# EAGLE design base (EAGLE 7.7.0)
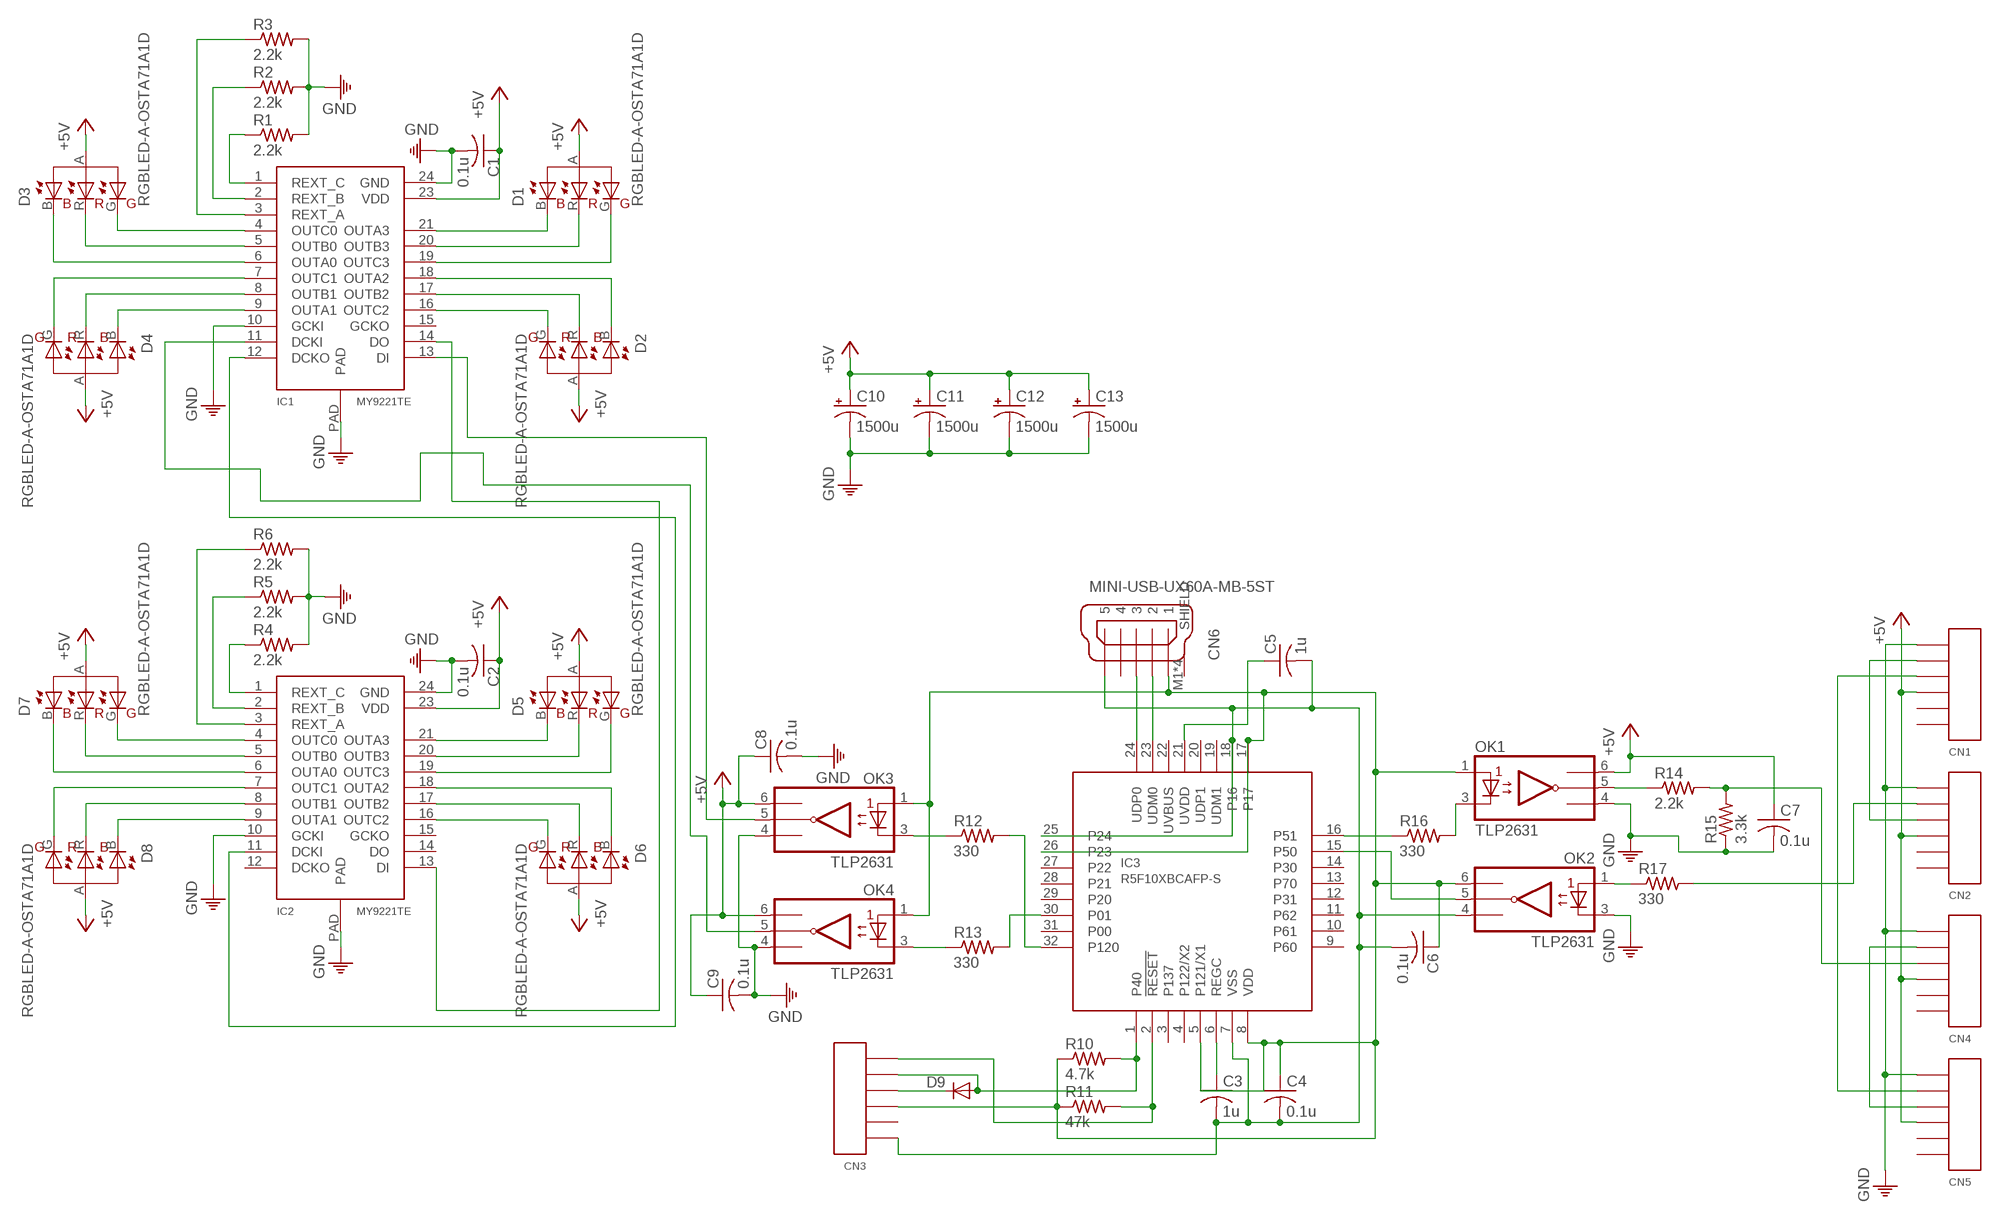
[diagram p0: schematic, sheet 1]

## Parts
C1  0.1u  C2012  [C2012]
C2  0.1u  C2012  [C2012]
C3  1u  C2012  [C2012]
C4  0.1u  C2012  [C2012]
C5  1u  C2012  [C2012]
C6  0.1u  C2012  [C2012]
C7  0.1u  C2012  [C2012]
C8  0.1u  C2012  [C2012]
C9  0.1u  C2012  [C2012]
C10  1500u  CCE3.5-8  [E3,5-8]
C11  1500u  CCE3.5-8  [E3,5-8]
C12  1500u  CCE3.5-8  [E3,5-8]
C13  1500u  CCE3.5-8  [E3,5-8]
CN1  PH-1X06SG  [PH-1X06SG]
CN2  PH-1X06SG  [PH-1X06SG]
CN3  PH-1X06SG  [PH-1X06SG]
CN4  PH-1X06SG  [PH-1X06SG]
CN5  PH-1X06SG  [PH-1X06SG]
CN6  MINI-USB-UX60A-MB-5ST  [UX60A-MB-5ST]
D1  RGBLED-A-OSTA71A1D  [OSTA71A1D]
D2  RGBLED-A-OSTA71A1D  [OSTA71A1D]
D3  RGBLED-A-OSTA71A1D  [OSTA71A1D]
D4  RGBLED-A-OSTA71A1D  [OSTA71A1D]
D5  RGBLED-A-OSTA71A1D  [OSTA71A1D]
D6  RGBLED-A-OSTA71A1D  [OSTA71A1D]
D7  RGBLED-A-OSTA71A1D  [OSTA71A1D]
D8  RGBLED-A-OSTA71A1D  [OSTA71A1D]
D9  D-SOD123  [SOD123]
IC1  MY9221TE  [MY9221TE]
IC2  MY9221TE  [MY9221TE]
IC3  R5F10XBCAFP-S  [P-LQFP32-7X7-0.80S]
OK1  TLP2631  [11-4L1S]
OK2  TLP2631  [11-4L1S]
OK3  TLP2631  [11-4L1S]
OK4  TLP2631  [11-4L1S]
R1  2.2k  R2012  [R2012]
R2  2.2k  R2012  [R2012]
R3  2.2k  R2012  [R2012]
R4  2.2k  R2012  [R2012]
R5  2.2k  R2012  [R2012]
R6  2.2k  R2012  [R2012]
R10  4.7k  R2012  [R2012]
R11  47k  R2012  [R2012]
R12  330  R2012  [R2012]
R13  330  R2012  [R2012]
R14  2.2k  R2012  [R2012]
R15  3.3k  R2012  [R2012]
R16  330  R2012  [R2012]
R17  330  R2012  [R2012]

## Nets
+5V: C1.1 C2.1 C7.1 C8.1 C9.1 C10.+ C11.+ C12.+ C13.+ CN1.P$4 CN2.P$4 CN4.P$4 CN5.P$4 D1.A(CA) D2.A(CA) D3.A(CA) D4.A(CA) D5.A(CA) D6.A(CA) D7.A(CA) D8.A(CA) IC1.23(VDD) IC2.23(VDD) OK1.6(VCC) OK3.6(VCC) OK4.6(VCC)
GND: C1.2 C2.2 C7.2 C8.2 C9.2 C10.- C11.- C12.- C13.- CN1.P$1 CN2.P$1 CN4.P$1 CN5.P$1 IC1.10(GCKI) IC1.24(GND) IC1.PAD IC2.10(GCKI) IC2.24(GND) IC2.PAD OK1.4(GND) OK2.3(C1) OK3.4(GND) OK4.4(GND) R1.2 R2.2 R3.2 R4.2 R5.2 R6.2 R15.1
N$1: D3.G(GC) IC1.4(OUTC0)
N$2: D3.R(RC) IC1.5(OUTB0)
N$3: D3.B(BC) IC1.6(OUTA0)
N$4: D4.G(GC) IC1.7(OUTC1)
N$5: D4.R(RC) IC1.8(OUTB1)
N$6: D4.B(BC) IC1.9(OUTA1)
N$7: D2.G(GC) IC1.16(OUTC2)
N$8: D2.R(RC) IC1.17(OUTB2)
N$9: D2.B(BC) IC1.18(OUTA2)
N$10: D1.G(GC) IC1.19(OUTC3)
N$11: D1.R(RC) IC1.20(OUTB3)
N$12: D1.B(BC) IC1.21(OUTA3)
N$13: D7.G(GC) IC2.4(OUTC0)
N$14: IC1.1(REXT_C) R1.1
N$15: IC1.2(REXT_B) R2.1
N$16: IC1.3(REXT_A) R3.1
N$17: D7.R(RC) IC2.5(OUTB0)
N$18: D7.B(BC) IC2.6(OUTA0)
N$19: D8.G(GC) IC2.7(OUTC1)
N$20: D8.R(RC) IC2.8(OUTB1)
N$21: D8.B(BC) IC2.9(OUTA1)
N$22: D6.G(GC) IC2.16(OUTC2)
N$23: D6.R(RC) IC2.17(OUTB2)
N$24: D6.B(BC) IC2.18(OUTA2)
N$25: D5.G(GC) IC2.19(OUTC3)
N$26: D5.R(RC) IC2.20(OUTB3)
N$27: D5.B(BC) IC2.21(OUTA3)
N$28: IC2.1(REXT_C) R4.1
N$29: IC2.2(REXT_B) R5.1
N$30: IC2.3(REXT_A) R6.1
N$31: IC1.14(DO) IC2.13(DI)
N$32: IC1.12(DCKO) IC2.11(DCKI)
N$33: IC3.30(P01) R13.2
N$34: CN3.P$3 D9.C
N$35: CN1.P$2 CN2.P$3
N$36: CN2.P$2 R17.2
N$37: CN4.P$2 CN5.P$3
N$38: CN3.P$2 D9.A IC3.1(P40) R10.2
N$39: CN1.P$3 CN5.P$2
N$40: CN4.P$3 R14.2 R15.2
N$41: CN6.2 IC3.23(UDM0)
N$42: CN6.3 IC3.24(UDP0)
N$44: CN3.P$1 IC3.2(!RESET!) R11.2
N$45: C4.1 C6.1 CN3.P$4 CN6.1 IC3.5(P121/X1) IC3.8(VDD) IC3.17 IC3.26(P23) OK1.1(A1) OK2.6(VCC) OK3.1(A1) OK4.1(A1) R10.1 R11.1
N$46: C3.1 IC3.6(REGC)
N$47: OK3.3(C1) R12.1
N$48: OK4.3(C1) R13.1
N$50: IC3.32(P120) R12.2
N$51: C3.2 C4.2 C5.2 C6.2 CN3.P$6 CN6.5 IC3.7(VSS) IC3.18(P16) IC3.25(P24) OK2.4(GND)
N$52: IC1.11(DCKI) OK4.5(VO1)
N$55: IC1.13(DI) OK3.5(VO1)
N$56: C5.1 IC3.21(UVDD)
N$58: OK1.5(VO1) R14.1
N$59: OK1.3(C1) R16.2
N$60: IC3.15(P50) OK2.5(VO1)
N$61: OK2.1(A1) R17.1
N$62: IC3.16(P51) R16.1
Unconnected: CN1.P$5 CN1.P$6 CN2.P$5 CN2.P$6 CN3.P$5 CN4.P$5 CN4.P$6 CN5.P$5 CN5.P$6 CN6.4 CN6.M1(SHIELD) CN6.M2(SHIELD) CN6.M3(SHIELD) CN6.M4(SHIELD) IC1.15(GCKO) IC2.12(DCKO) IC2.14(DO) IC2.15(GCKO) IC3.3(P137) IC3.4(P122/X2) IC3.9(P60) IC3.10(P61) IC3.11(P62) IC3.12(P31) IC3.13(P70) IC3.14(P30) IC3.19(UDM1) IC3.20(UDP1) IC3.22(UVBUS) IC3.27(P22) IC3.28(P21) IC3.29(P20) IC3.31(P00)

## Library data of the parts
C1-C9 = MyLib:C: CAPACITOR, American symbol
C10-C13 = MyLib:CC: POLARIZED CAPACITOR, American symbol
CN1-CN5 = MyLib:PH-1X06
CN6 = MyLib:MINI-USB-: MINI USB Connector Source: http://www.hirose.co.jp/cataloge_hp/e24000019.pdf
D1-D8 = MyLib:RGBLED-A
D9 = MyLib:D
IC1 IC2 = MyLib:MY9221
IC3 = MyLib:R5F10XBC*FP
OK1-OK4 = MyLib:TLP2631
R1-R6 R10-R17 = MyLib:R: RESISTOR, American symbol

## Board
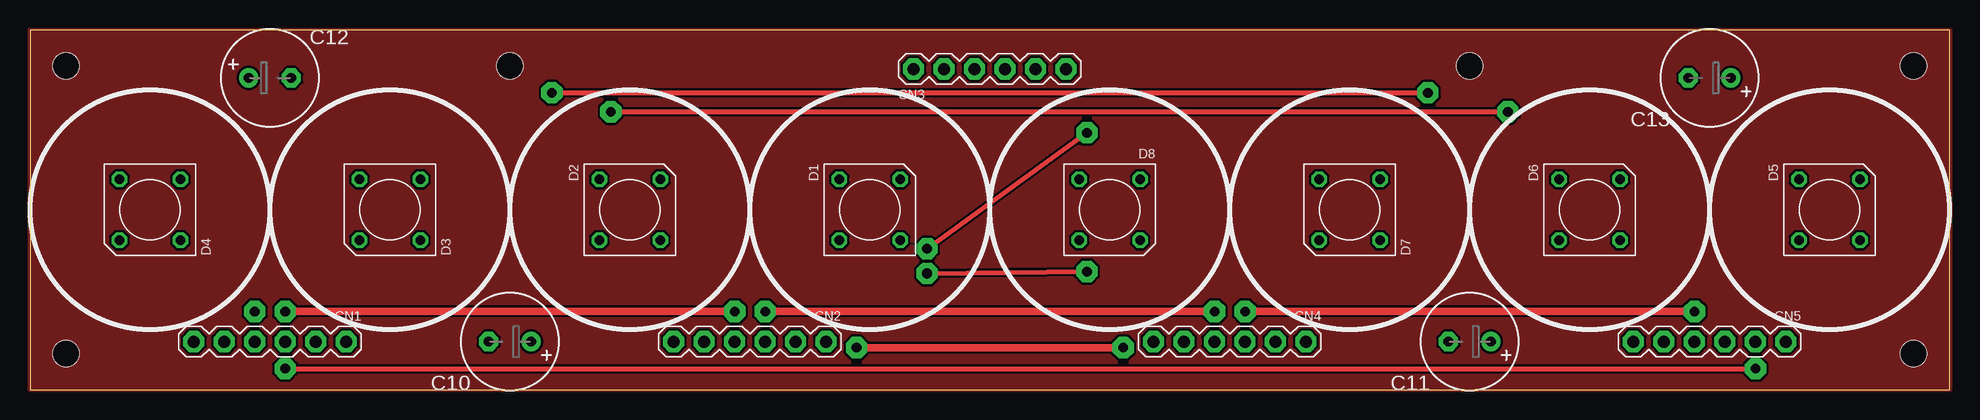
[diagram p1: board, top side]
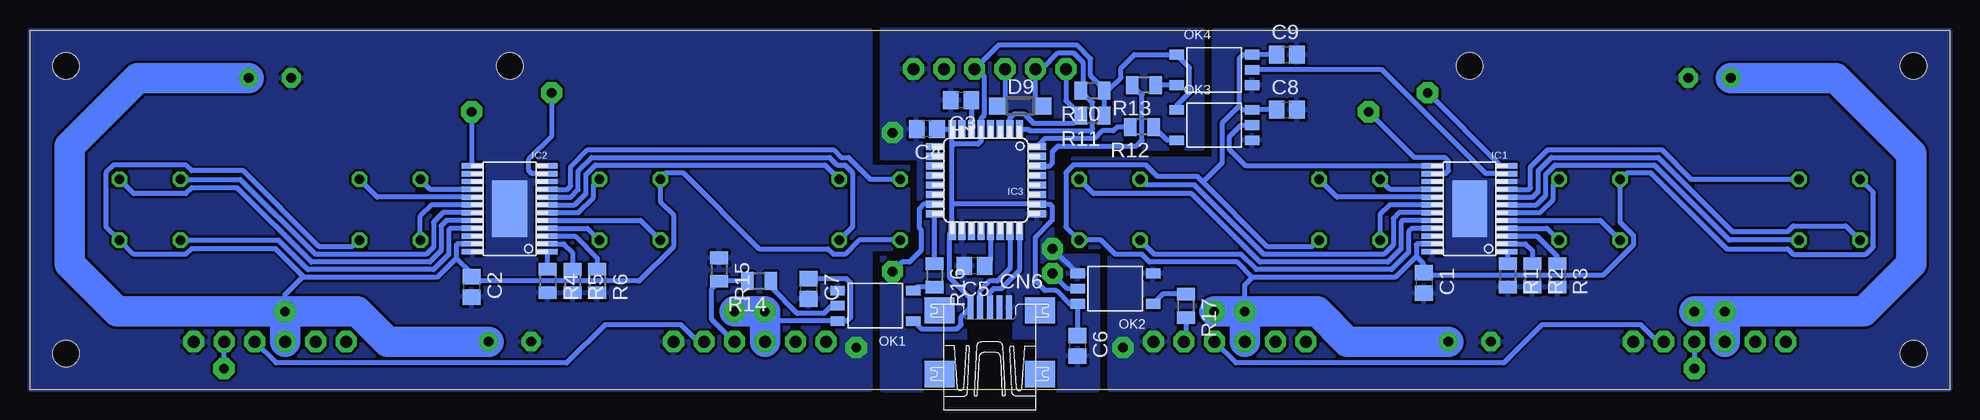
[diagram p2: board, bottom side, seen from below]

Size 160 x 30 mm. Coordinates in mm from the lower left corner, seen from the top.
Outline: 0,0 160,0 160,30 0,30 0,0
Copper layers (1*16): Top 0.0356mm / dielectric 1.5011mm / Bottom 0.0356mm
Design rules "formitaminimum *": minimum track width 5mil, minimum drill 0.5994mm, track to track 0.2007mm, track to pad 0.2007mm, pad to pad 0.2007mm, via to via 0.2007mm, smd to smd 0mil, copper to edge 0mil, drill to drill 1mil, minimum pad ring 10mil, minimum via ring 8mil, stop-mask expansion 4mil, vias tented up to drill 0mil, thermal gap 10mil
Holes 2.2 mm at 3,3 3,27 157,3 157,27 40,27 120,27

### Footprints (pad centres in the part's own frame; a part is rotated, then mirrored left to right if it is on the bottom)
C2012 = smd 1.3 x 1.5: 1 -0.85,0; 2 0.85,0
E3,5-8 = drill 0.813 pad 1.6: + -1.778,0 | drill 0.813 pad 1.6 octagon: - 1.778,0
PH-1X06SG = drill 1 pad 1.778 octagon: P$1 -6.35,0; P$2 -3.81,0; P$3 -1.27,0; P$4 1.27,0; P$5 3.81,0; P$6 6.35,0
UX60A-MB-5ST = smd 2 x 0.5: 1 2.25,1.6; 2 2.25,0.8; 3 2.25,0; 4 2.25,-0.8; 5 2.25,-1.6 | smd 2.2 x 2.5: M1 -3.3,-4.2; M2 -3.3,4.2; M3 2,4.2; M4 2,-4.2
OSTA71A1D = drill 0.8 octagon: A 2.54,2.54; B 2.54,-2.54; G -2.54,-2.54; R -2.54,2.54
SOD123 = smd 1.4 x 1.4: A 1.9,0; C -1.9,0
MY9221TE = smd 1.8 x 0.45: 1 -3.1,3.575; 2 -3.1,2.925; 3 -3.1,2.275; 4 -3.1,1.625; 5 -3.1,0.975; 6 -3.1,0.325; 7 -3.1,-0.325; 8 -3.1,-0.975; 9 -3.1,-1.625; 10 -3.1,-2.275; 11 -3.1,-2.925; 12 -3.1,-3.575; 13 3.1,-3.575; 14 3.1,-2.925; 15 3.1,-2.275; 16 3.1,-1.625; 17 3.1,-0.975; 18 3.1,-0.325; 19 3.1,0.325; 20 3.1,0.975; 21 3.1,1.625; 22 3.1,2.275; 23 3.1,2.925; 24 3.1,3.575 | smd 2.9 x 4.7: PAD 0,0
P-LQFP32-7X7-0.80S = smd 0.6 x 1.5: 1 -2.8,-4.25; 2 -2,-4.25; 3 -1.2,-4.25; 4 -0.4,-4.25; 5 0.4,-4.25; 6 1.2,-4.25; 7 2,-4.25; 8 2.8,-4.25; 17 2.8,4.25; 18 2,4.25; 19 1.2,4.25; 20 0.4,4.25; 21 -0.4,4.25; 22 -1.2,4.25; 23 -2,4.25; 24 -2.8,4.25 | smd 1.5 x 0.6: 9 4.25,-2.8; 10 4.25,-2; 11 4.25,-1.2; 12 4.25,-0.4; 13 4.25,0.4; 14 4.25,1.2; 15 4.25,2; 16 4.25,2.8; 25 -4.25,2.8; 26 -4.25,2; 27 -4.25,1.2; 28 -4.25,0.4; 29 -4.25,-0.4; 30 -4.25,-1.2; 31 -4.25,-2; 32 -4.25,-2.8
11-4L1S = smd 1.2 x 0.8: 1 -3.15,1.27; 3 -3.15,-1.27; 4 3.15,-1.27; 5 3.15,0; 6 3.15,1.27
R2012 = smd 1.046 x 1.5: 1 -0.977,0; 2 0.977,0

### Placement (x,y rotation side)
C1  43.82,8.89 270 bottom
C2  123.19,8.57 270 bottom
C3  82.39,24.13 180 bottom
C4  85.25,21.75 180 bottom
C5  81.28,10.32 180 bottom
C6  72.71,3.65 270 bottom
C7  95.09,8.41 270 bottom
C8  55.24,23.34 0 bottom
C9  55.24,27.94 0 bottom
C10  40,4 180 top
C11  120,4 180 top
C12  20,26 0 top
C13  140,26 180 top
CN1  20,4 180 top
CN2  60,4 180 top
CN3  80,26.75 0 top
CN4  100,4 180 top
CN5  140,4 180 top
CN6  80,4.6 90 bottom
D1  70,15 270 top
D2  50,15 270 top
D3  30,15 90 top
D4  10,15 90 top
D5  150,15 270 top
D6  130,15 270 top
D7  110,15 90 top
D8  90,15 180 top
D9  77.47,23.65 0 bottom
IC1  40.01,15.08 180 bottom
IC2  120.02,15.08 180 bottom
IC3  80.33,17.46 180 bottom
OK1  89.53,6.99 180 bottom
OK2  69.53,8.41 180 bottom
OK3  61.28,22.07 0 bottom
OK4  61.28,26.67 0 bottom
R1  36.83,9.53 270 bottom
R2  34.77,9.53 270 bottom
R3  32.7,9.53 270 bottom
R4  116.84,9.05 270 bottom
R5  114.78,9.05 270 bottom
R6  112.71,9.05 270 bottom
R10  71.44,24.92 180 bottom
R11  71.44,22.86 180 bottom
R12  67.31,21.91 180 bottom
R13  67.15,25.4 180 bottom
R14  99.22,9.05 180 bottom
R15  102.55,10 270 bottom
R16  84.61,9.53 270 bottom
R17  63.66,6.99 270 bottom

### Tracks (layer width: path | path; a pad name or v marks a point on that pad's centre or on a via)
+5V  (via drill 0.8 pad 1.78)
  Top 0.61: v138.75,6.51 v101.28,6.51 | v98.74,6.51 v61.28,6.51 | v58.74,6.51 v21.27,6.51
  Bottom 0.406: D4.A 6.35,16.43 6.35,11.91 6.99,11.27 13.02,11.27 13.49,11.75 18.57,11.75 24.93,18.1 26.83,18.1 27.39,17.54 D3.A 27.46,13.96 26.35,12.86 26.35,12.06 28.89,9.53 43.6,9.53 C1.1 43.82,10.48 44.45,11.11 | D2.A 52.63,12.46 53.18,11.91 56.83,11.91 62.23,17.3 | IC1.23 44.36,12.16 44.45,12.06 44.45,11.11 | 44.45,11.11 46.2,9.37 58.1,9.37 | IC2.23 124.37,12.16 124.46,12.06 124.46,10.95 | 124.46,10.95 126.05,9.37 137.16,9.37 137.24,9.45 | 137.24,9.45 139.54,11.75 146.53,11.75 147,11.27 151.35,11.27 D5.A 153.67,13.59 153.67,18.1 153.03,18.73 147,18.73 146.53,18.26 142.24,18.26 135.89,11.91 133.19,11.91 132.64,12.46 D6.A | 124.46,10.95 123.19,9.68 C2.1 122.82,9.05 109.22,9.05 106.36,11.91 106.36,14.61 107.46,15.7 D7.A 107.46,17.64 107,18.1 105.57,18.1 99.22,11.75 93.5,11.75 93.03,11.27 92.08,11.27 90.89,12.46 D8.A | v58.73,6.5 58.73,8.74 58.1,9.37 | 138.73,6.49 138.73,7.96 137.24,9.45 | C9.1 OK4.6 58.9,27.94 59.21,27.62 59.21,23.65 | C8.1 OK3.6 58.9,23.34 59.21,23.65 | 59.21,23.65 60.64,22.23 60.64,18.89 62.23,17.3 | v98.74,6.51 97.95,5.71 OK1.6 91.92,5.71 91.6,6.03 91.6,8.89 91.97,9.26 C7.1 | 62.23,17.3 62.71,17.78 66.04,17.78 66.99,18.73 73.03,18.73 73.66,18.1 73.66,13.58 D1.A 70.72,12.46 69.53,11.27 67.31,11.27 66.67,10.64 59.37,10.64 58.1,9.37
  Bottom 2.54: CN1.P$4 v18.73,6.51 | CN2.P$4 v58.73,6.5 v58.74,6.51 | CN4.P$4 98.73,6.5 v98.74,6.51 v101.28,6.51 | CN5.P$4 138.73,6.49 v138.75,6.51 | v21.27,6.51 v18.73,6.51 | v61.28,6.51 v58.74,6.51 | C12.+ 9.49,26 3.17,19.68 3.17,10.48 7.14,6.51 v18.73,6.51 | C13.+ 151.01,26 156.69,20.32 156.69,10.48 152.72,6.51 v138.75,6.51 | C11.+ 130.21,4 132.72,6.51 v138.75,6.51 | C10.+ 50.2,4 52.7,6.51 v58.74,6.51
GND  (via drill 0.8 pad 1.78)
  Top 0.61: v91.12,3.49 v68.9,3.49
  pour Bottom: 0,0 70,0 70,11.91 73.18,11.91 73.18,19.21 61.27,19.21 61.27,30 0,30
  pour Bottom (no thermals): 37.47,18.26 42.7,18.26 42.7,12.06 37.47,12.06
  pour Bottom (no thermals): 116.36,18.57 123.03,18.57 123.03,12.06 116.36,12.06
  pour Bottom: 160,0 160,30 90,30 90,18.57 86.84,18.57 86.84,11.75 90,11.75 90,0
N$1
  Bottom 0.406: IC1.4 33.54,13.46 D3.G
N$2
  Bottom 0.406: IC1.5 29.11,14.11 D3.R
N$3
  Bottom 0.406: IC1.6 34.14,14.76 33.02,15.88 33.02,17.06 D3.B
N$4
  Bottom 0.406: IC1.7 34.44,15.41 33.66,16.19 33.66,17.94 32.86,18.73 24.61,18.73 18.34,12.46 D4.G
N$5
  Bottom 0.406: IC1.8 34.74,16.06 34.29,16.51 34.29,18.26 33.18,19.37 24.29,19.37 18.1,13.18 13.49,13.18 13.02,13.65 8.65,13.65 D4.R
N$6
  Bottom 0.406: IC1.9 35.05,16.71 34.93,16.83 34.93,18.57 33.5,20 23.97,20 21.51,17.54 D4.B
N$7
  Bottom 0.406: IC1.16 46.63,16.71 D2.G
N$8
  Bottom 0.406: IC1.17 51.06,16.06 D2.R
N$9
  Bottom 0.406: IC1.18 46.67,15.41 47.47,14.61 D2.B
N$10
  Bottom 0.406: IC1.19 45.89,14.76 46.36,14.29 46.36,12.06 47.15,11.27 57.15,11.27 62.94,17.06 66.98,17.06 D1.G
N$11
  Bottom 0.406: IC1.20 45.59,14.11 45.72,13.97 45.72,11.75 46.83,10.64 57.47,10.64 63.18,16.35 71.35,16.35 D1.R
N$12
  Bottom 0.406: IC1.21 44.81,13.46 45.09,13.18 45.09,11.43 46.52,10 57.79,10 59.06,11.27 66.27,11.27 D1.B
N$13
  Bottom 0.406: IC2.4 113.54,13.46 D7.G
N$14
  Bottom 0.406: R1.1 36.83,11.43 IC1.1
N$15
  Bottom 0.406: IC1.2 35.34,12.16 34.77,11.59 R2.1
N$16
  Bottom 0.406: IC1.3 34.4,12.81 32.7,11.11 R3.1
N$17
  Bottom 0.406: IC2.5 109.11,14.11 D7.R
N$18
  Bottom 0.406: IC2.6 114.31,14.76 113.03,16.03 113.03,17.05 D7.B
N$19
  Bottom 0.406: IC2.7 114.61,15.41 113.67,16.35 113.67,17.94 112.87,18.73 93.73,18.73 D8.G
N$20
  Bottom 0.406: IC2.8 114.91,16.06 114.3,16.67 114.3,18.26 113.19,19.37 93.34,19.37 92.71,18.73 92.08,18.73 91.44,18.1 91.44,13.56 D8.R
N$21
  Bottom 0.406: IC2.9 115.22,16.71 114.94,16.99 114.94,18.57 113.51,20 93.03,20 92.39,19.37 91.76,19.37 89.93,17.54 D8.B
N$22
  Bottom 0.406: IC2.16 126.63,16.71 D6.G
N$23
  Bottom 0.406: IC2.17 131.06,16.06 D6.R
N$24
  Bottom 0.406: IC2.18 126.52,15.41 127.46,14.46 D6.B
N$25
  Bottom 0.406: IC2.19 125.58,14.76 126.36,13.97 126.36,11.91 127,11.27 136.21,11.27 142.48,17.54 D5.G
N$26
  Bottom 0.406: IC2.20 125.28,14.11 125.73,13.65 125.73,11.59 126.68,10.64 136.53,10.64 142.72,16.83 146.53,16.83 147,16.35 151.35,16.35 D5.R
N$27
  Bottom 0.406: IC2.21 124.97,13.46 125.09,13.34 125.09,11.27 126.36,10 136.84,10 139.3,12.46 D5.B
N$28
  Bottom 0.406: R4.1 116.84,11.43 IC2.1
N$29
  Bottom 0.406: IC2.2 115.5,12.16 114.78,11.43 R5.1
N$30
  Bottom 0.406: IC2.3 114.56,12.81 112.71,10.95 R6.1
N$31  (via drill 0.8 pad 1.78)
  Top 0.406: v48.42,23.18 v123.19,23.18
  Bottom 0.406: IC1.14 42,18.01 41.75,18.26 41.75,19.05 42.07,19.37 44.61,19.37 v48.42,23.18 | v123.19,23.18 123.19,18.73 IC2.13
N$32  (via drill 0.8 pad 1.78)
  Top 0.406: v43.5,24.77 v116.52,24.77
  Bottom 0.406: v116.52,24.77 116.52,21.11 118.43,19.21 118.43,18.26 118.18,18.01 IC2.11 | IC1.12 37.39,18.66 v43.5,24.77
N$33
  Bottom 0.406: R13.2 67.31,24.58 67.31,20.8 67.79,20.32 74.3,20.32 74.77,19.84 74.77,18.89 75,18.66 IC3.30
N$34
  Bottom 0.406: CN3.P$3 78.73,24.29 D9.C
N$35
  Bottom 0.406: CN1.P$2 24.32,4 25.72,5.4 33.97,5.4 37.15,2.22 59.49,2.22 CN2.P$3
N$36
  Bottom 0.406: R17.2 63.66,4.15 CN2.P$2
N$37
  Bottom 0.406: CN4.P$2 104.33,4 105.73,5.4 112.08,5.4 115.25,2.22 139.49,2.22 CN5.P$3
N$38
  Bottom 0.406: IC3.1 76.8,21.71 76.68,21.59 71.6,21.59 71.44,21.75 71.44,23.95 R10.2 72.23,25.11 72.23,27.3 73.03,28.1 74.3,28.1 75.64,26.75 CN3.P$2 76.19,24.27 D9.A
N$39  (via drill 0.8 pad 1.78)
  Top 0.406: v21.27,1.75 v143.83,1.75
  Bottom 0.406: CN1.P$3 v21.27,1.75 | v143.83,1.75 143.83,3.98 CN5.P$2
N$40
  Bottom 0.406: R14.2 102.53,9.05 R15.2 103.19,8.39 103.19,5.87 101.31,4 CN4.P$3
N$41
  Bottom 0.406: CN6.2 80.8,8.26 80.01,9.05 79.38,9.05 78.33,10.1 IC3.23
N$42
  Bottom 0.406: IC3.24 77.53,9.94 79.06,8.41 79.69,8.41 80,8.11 CN6.3
N$43
  pour Top: 0,0 0,30 160,30 160,0
N$44
  Bottom 0.406: IC3.2 78.33,22.64 77.95,23.02 77.15,23.02 76.36,22.23 73.05,22.23 R11.2 73.65,24.1 CN3.P$1
N$45
  Bottom 0.406: 83.13,15.4 IC3.17 83.34,13 83.34,9.37 81.6,7.62 CN6.1 82.39,6.06 82.39,5.4 82.71,5.08 85.72,5.08 86.36,5.71 OK1.1 | 83.13,15.4 83.13,20.32 | 83.13,20.32 IC3.8 83.16,21.75 C4.1 | 83.13,15.4 83.06,15.46 IC3.26 74.99,15.46 74.77,15.24 74.77,14.13 76.2,12.7 76.2,9.05 75.41,8.26 74.45,8.26 73.34,7.14 OK2.6 72.68,4.53 C6.1 | 83.13,20.32 82.97,20.48 80.96,20.48 80.73,20.71 IC3.5 80.73,22.62 80.49,22.86 80.49,26.19 81.04,26.75 CN3.P$4 79.29,28.73 72.71,28.73 71.6,27.62 71.6,26.19 70.46,25.06 R10.1 | R10.1 R11.1 | OK3.1 64.43,23.68 63.34,24.77 63.34,26.85 OK4.1 67.94,27.94 69.06,26.83 69.06,26.04 70.17,24.92 R10.1
N$46
  Bottom 0.406: C3.1 81.54,21.73 IC3.6
N$47
  Bottom 0.406: OK3.3 65.22,20.8 R12.1
N$48
  Bottom 0.406: OK4.3 R13.1
N$50
  Bottom 0.406: R12.2 69.37,21.91 69.69,21.59 70.64,21.59 71.28,20.95 75.39,20.95 IC3.32
N$51  (via drill 0.8 pad 1.78)
  Top 0.406: v74.77,11.75 v88.11,21.43
  Bottom 0.406: OK2.4 72.71,9.68 v74.77,11.75
  pour Bottom: 71,0 71,11.11 74.77,11.11 74.77,20.16 62.27,20.16 62.27,30 89,30 89,19.37 85.88,19.37 85.88,10.95 89,10.95 89,0
N$52
  Bottom 0.406: IC1.11 38.64,18.01 47.31,26.67 OK4.5
N$55
  Bottom 0.406: IC1.13 58.66,18.66 60.01,20 60.01,21.11 59.05,22.07 OK3.5
N$56
  Bottom 0.406: IC3.21 79.93,10.82 C5.1
N$58
  Bottom 0.406: OK1.5 93.19,6.99 93.82,6.35 96.04,6.35 98.24,8.55 R14.1
N$59
  Bottom 0.406: R16.2 86.09,8.55 OK1.3
N$60  (via drill 0.8 pad 1.78)
  Top 0.406: v74.77,9.68 v88.11,9.84
  Bottom 0.406: OK2.5 73.5,8.41 v74.77,9.68 | IC3.15 85.5,15.46 85.88,15.08 85.88,13.49 85.72,13.34 85.72,11.59 86.68,10.64 87.31,10.64 v88.11,9.84
N$61
  Bottom 0.406: R17.1 65.56,7.96 OK2.1
N$62
  Bottom 0.406: R16.1 84.61,14.63 IC3.16